# EAGLE schematic VCA-R2 (EAGLE 7.7.0)
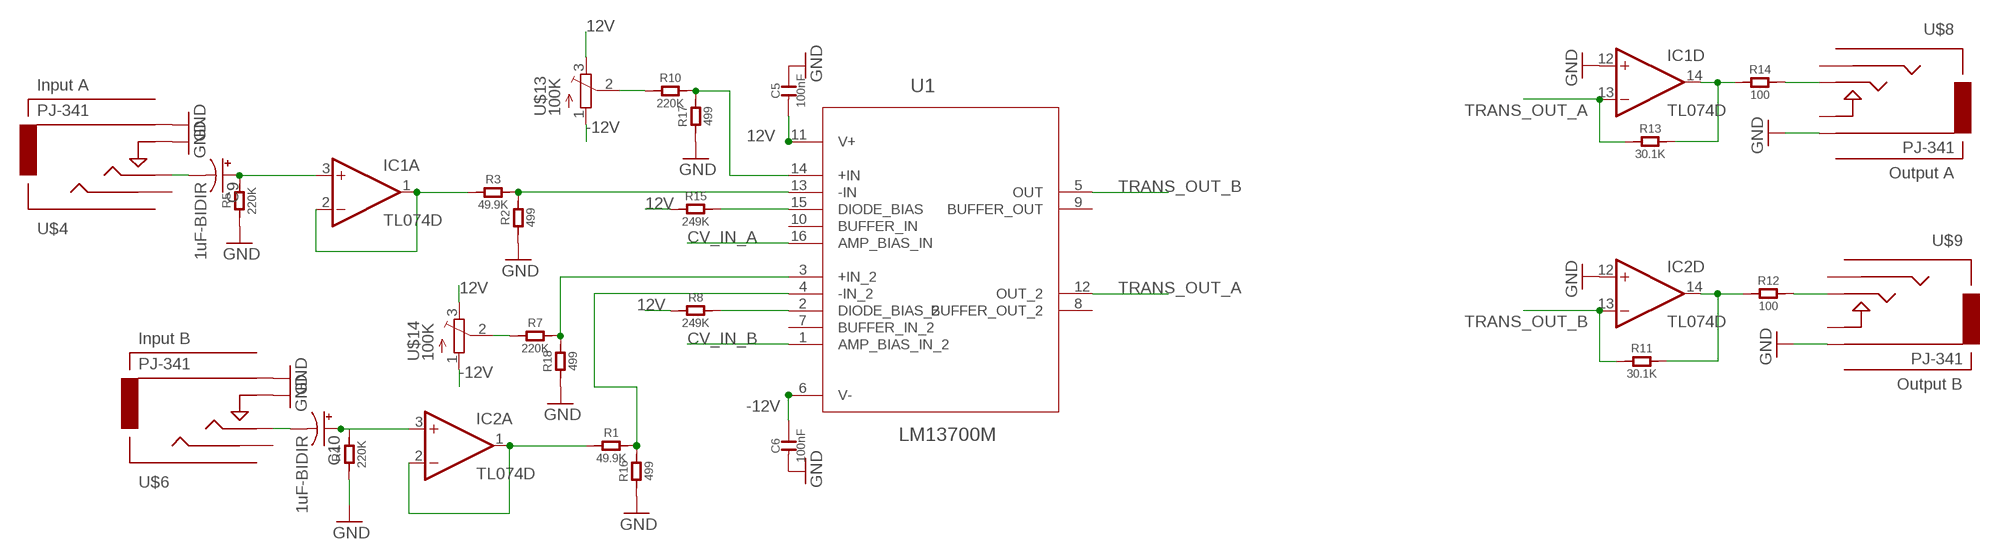
[diagram p0: schematic, sheet 1, part 1 of 2]
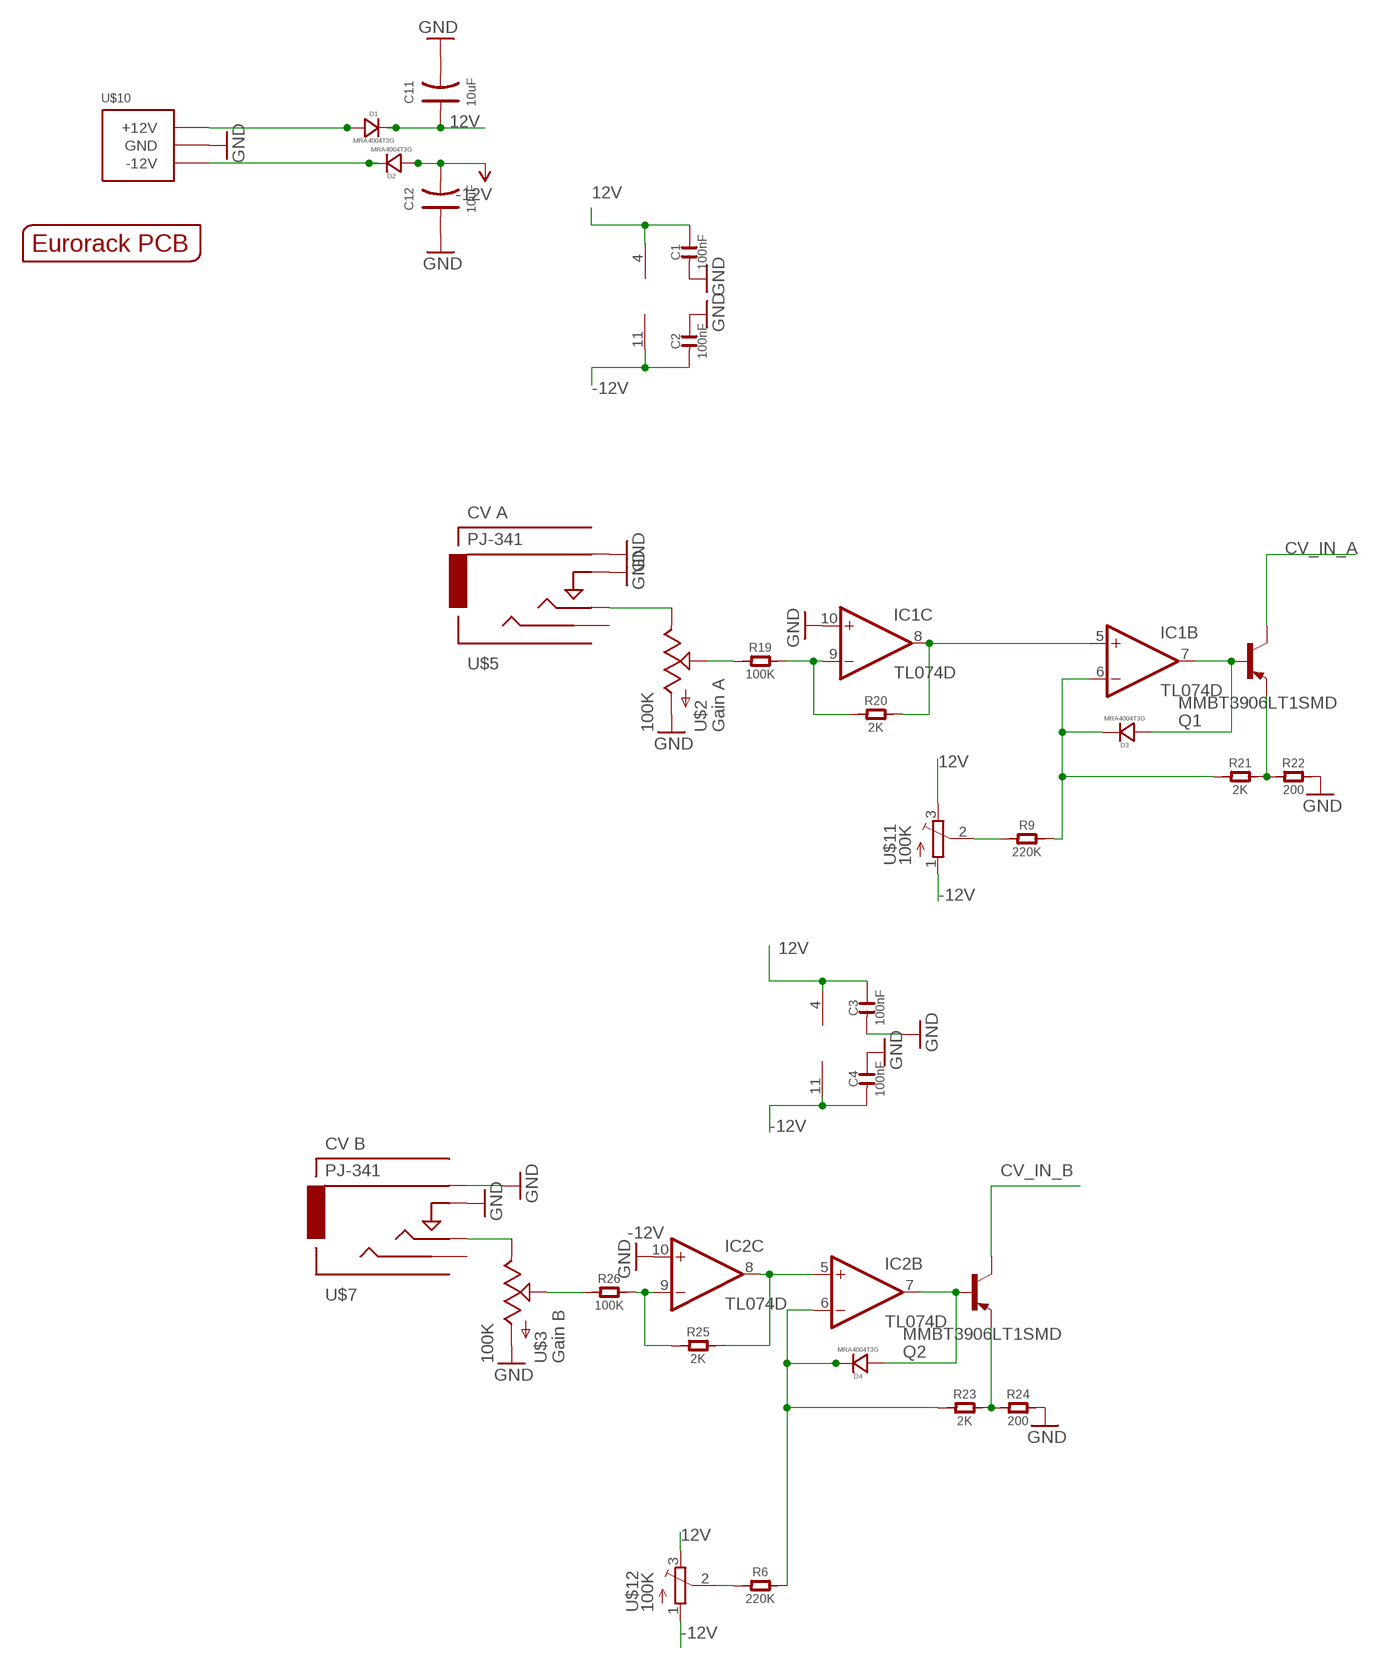
[diagram p1: schematic, sheet 1, part 2 of 2]

## Parts
C1  100nF  C-0603  [C0603]
C2  100nF  C-0603  [C0603]
C3  100nF  C-0603  [C0603]
C4  100nF  C-0603  [C0603]
C5  100nF  C-0603  [C0603]
C6  100nF  C-0603  [C0603]
C9  1uF-BIDIR  CPOL-US153CLV-0505  [153CLV-0505]
C10  1uF-BIDIR  CPOL-US153CLV-0505  [153CLV-0505]
C11  10uF  C-POLAR-A  [AVX-A]
C12  10uF  C-POLAR-A  [AVX-A]
D1  MRA4004T3G  D-SMA  [DO-214AC]
D2  MRA4004T3G  D-SMA  [DO-214AC]
D3  MRA4004T3G  D-SMA  [DO-214AC]
D4  MRA4004T3G  D-SMA  [DO-214AC]
IC1  TL074D  [SO14]
IC2  TL074D  [SO14]
Q1  MMBT3906LT1SMD  [SOT23-BEC]
Q2  MMBT3906LT1SMD  [SOT23-BEC]
R1  49.9K  R  [C0805]
R2  499  R  [C0805]
R3  49.9K  R  [C0805]
R4  220K  R  [C0805]
R5  220K  R  [C0805]
R6  220K  R  [C0805]
R7  220K  R  [C0805]
R8  249K  R  [C0805]
R9  220K  R  [C0805]
R10  220K  R  [C0805]
R11  30.1K  R  [C0805]
R12  100  R  [C0805]
R13  30.1K  R  [C0805]
R14  100  R  [C0805]
R15  249K  R  [C0805]
R16  499  R  [C0805]
R17  499  R  [C0805]
R18  499  R  [C0805]
R19  100K  R  [C0805]
R20  2K  R  [C0805]
R21  2K  R  [C0805]
R22  200  R  [C0805]
R23  2K  R  [C0805]
R24  200  R  [C0805]
R25  2K  R  [C0805]
R26  100K  R  [C0805]
U1  LM13700M  [SOIC127P620X175-16N]
U$1  EURORACK_PCB4HP  [EURORACK4HPPCB]
U$2  100K  POTZEPHPOT  [OG-POTS_ALPS_POT_VERTICAL]
U$3  100K  POTZEPHPOT  [OG-POTS_ALPS_POT_VERTICAL]
U$4  PJ-341  AUDIO-JACKINPUT  [3.5MM-JACK-SWITCH-13MM-INPUT]
U$5  PJ-341  AUDIO-JACKINPUT  [3.5MM-JACK-SWITCH-13MM-INPUT]
U$6  PJ-341  AUDIO-JACKINPUT  [3.5MM-JACK-SWITCH-13MM-INPUT]
U$7  PJ-341  AUDIO-JACKINPUT  [3.5MM-JACK-SWITCH-13MM-INPUT]
U$8  PJ-341  AUDIO-JACKOUTPUT  [3.5MM-JACK-SWITCH-13MM-OUTPUT]
U$9  PJ-341  AUDIO-JACKOUTPUT  [3.5MM-JACK-SWITCH-13MM-OUTPUT]
U$10  POWER_SIMPLE10  [POWER_10]
U$11  100K  TRIMPOTTC33X  [TC33X]
U$12  100K  TRIMPOTTC33X  [TC33X]
U$13  100K  TRIMPOTTC33X  [TC33X]
U$14  100K  TRIMPOTTC33X  [TC33X]

## Nets
12V: C1.2 C3.2 C5.1 C11.+ D1.2(-) IC1.4(P:V+) IC2.4(P:V+) R8.1 R15.1 U1.11(V+) U$11.3(E) U$12.3(E) U$13.3(E) U$14.3(E)
-12V: C2.1 C4.1 C6.2 C12.- D2.1(+) IC1.11(P:V-) IC2.11(P:V-) U1.6(V-) U$11.1(A) U$12.1(A) U$13.1(A) U$14.1(A)
CV_IN_A: Q1.C U1.16(AMP_BIAS_IN)
CV_IN_B: Q2.C U1.1(AMP_BIAS_IN_2)
GND: C1.1 C2.2 C3.1 C4.2 C5.2 C6.1 C11.- C12.+ IC1.10(C:+IN) IC1.12(D:+IN) IC2.10(C:+IN) IC2.12(D:+IN) R2.1 R4.1 R5.1 R16.1 R17.1 R18.1 R22.2 R24.2 U$2.P$3(A) U$3.P$3(A) U$4.RING@3(RING) U$4.SWITCH@3(SWITCH) U$5.RING@3(RING) U$5.SWITCH@3(SWITCH) U$6.RING@3(RING) U$6.SWITCH@3(SWITCH) U$7.RING@3(RING) U$7.SWITCH@3(SWITCH) U$8.RING@3(RING) U$9.RING@3(RING) U$10.3(GND) U$10.4(GND) U$10.5(GND) U$10.6(GND) U$10.7(GND) U$10.8(GND)
N$1: R14.2 U$8.TIP@3(TIP)
N$2: IC1.14(D:OUT) R13.2 R14.1
N$3: R8.2 U1.2(DIODE_BIAS_2)
N$4: R15.2 U1.15(DIODE_BIAS)
N$5: R12.2 U$9.TIP@3(TIP)
N$6: IC2.14(D:OUT) R11.2 R12.1
N$7: R19.1 U$2.P$2(S)
N$8: R10.1 U$13.2(S)
N$9: R9.1 U$11.2(S)
N$10: R7.1 U$14.2(S)
N$11: R6.1 U$12.2(S)
N$12: C9.- U$4.TIP@3(TIP)
N$13: C10.- U$6.TIP@3(TIP)
N$14: C9.+ IC1.3(A:+IN) R5.2
N$15: C10.+ IC2.3(A:+IN) R4.2
N$16: IC1.1(A:OUT) IC1.2(A:-IN) R3.1
N$18: IC2.1(A:OUT) IC2.2(A:-IN) R1.1
N$19: R2.2 R3.2 U1.13(-IN)
N$20: R1.2 R16.2 U1.4(-IN_2)
N$21: R10.2 R17.2 U1.14(+IN)
N$22: U$3.P$1(E) U$7.TIP@3(TIP)
N$23: R7.2 R18.2 U1.3(+IN_2)
N$24: U$2.P$1(E) U$5.TIP@3(TIP)
N$25: IC1.9(C:-IN) R19.2 R20.1
N$26: IC1.5(B:+IN) IC1.8(C:OUT) R20.2
N$27: D3.2(-) IC1.6(B:-IN) R9.2 R21.1
N$28 [heavypower]: D1.1(+) U$10.9(+12V) U$10.10(+12V)
N$29: D3.1(+) IC1.7(B:OUT) Q1.B
N$30: Q1.E R21.2 R22.1
N$32: D4.2(-) IC2.6(B:-IN) R6.2 R23.1
N$33: D4.1(+) IC2.7(B:OUT) Q2.B
N$34: Q2.E R23.2 R24.1
N$37: IC2.5(B:+IN) IC2.8(C:OUT) R25.2
N$38: R26.1 U$3.P$2(S)
N$39: IC2.9(C:-IN) R25.1 R26.2
N$64 [heavypower]: D2.2(-) U$10.1(-12V) U$10.2(-12V)
TRANS_OUT_A: IC1.13(D:-IN) R13.1 U1.12(OUT_2)
TRANS_OUT_B: IC2.13(D:-IN) R11.1 U1.5(OUT)
Unconnected: U1.7(BUFFER_IN_2) U1.8(BUFFER_OUT_2) U1.9(BUFFER_OUT) U1.10(BUFFER_IN) U$4.SECOND@3(SECOND) U$5.SECOND@3(SECOND) U$6.SECOND@3(SECOND) U$7.SECOND@3(SECOND) U$8.SECOND@3(SECOND) U$8.SWITCH@3(SWITCH) U$9.SECOND@3(SECOND) U$9.SWITCH@3(SWITCH)

## Library data of the parts
C1-C6 = OPL:C*
C9 C10 = adafruit:CPOL-US: POLARIZED CAPACITOR, American symbol
C11 C12 = OPL:C-POLAR*
D1-D4 = OPL:D*: DIODE; MF: VISHAY; MPN: US1G-E3/5AT; OC_FARNELL: 9551824
IC1 IC2 = EurorackModularParts:TL074: OP AMP
Q1 Q2 = transistor-pnp:MMBT3906*: PNP Transistror
R1-R26 = OPL:R*
U1 = FarnellThings:LM13700M: Dual Operational Transconductance Amplifiers; MPN: LM13700M; OC_FARNELL: 1468910; OC_NEWARK: 41K3505; PACKAGE: SOIC-16; SUPPLIER: National Semiconductor
U$1 = EurorackModularParts:EURORACK_PCB
U$2 = EurorackModularParts:POT; DESC: Gain A
U$3 = EurorackModularParts:POT; DESC: Gain B
U$4 = EurorackModularParts:AUDIO-JACK: Switching Mono 3.5mm Audio Jack from Erthenvar.; DESC: Input A; MPN: PJ-341
U$5 = EurorackModularParts:AUDIO-JACK: Switching Mono 3.5mm Audio Jack from Erthenvar.; DESC: CV A; MPN: PJ-341
U$6 = EurorackModularParts:AUDIO-JACK: Switching Mono 3.5mm Audio Jack from Erthenvar.; DESC: Input B; MPN: PJ-341
U$7 = EurorackModularParts:AUDIO-JACK: Switching Mono 3.5mm Audio Jack from Erthenvar.; DESC: CV B; MPN: PJ-341
U$8 = EurorackModularParts:AUDIO-JACK: Switching Mono 3.5mm Audio Jack from Erthenvar.; DESC: Output A; MPN: PJ-341
U$9 = EurorackModularParts:AUDIO-JACK: Switching Mono 3.5mm Audio Jack from Erthenvar.; DESC: Output B; MPN: PJ-341
U$10 = EurorackModularParts:POWER_SIMPLE
U$11-U$14 = adafruit:TRIMPOT: SMT trimmer potentiometer part number TC33X http://www.ladyada.net/library/eagle

## Net classes
0 default: width 0.305 mm
1 heavypower: width 0.381 mm